# Altium project WiWi_SDR.PrjPcb (part 1 of 2)
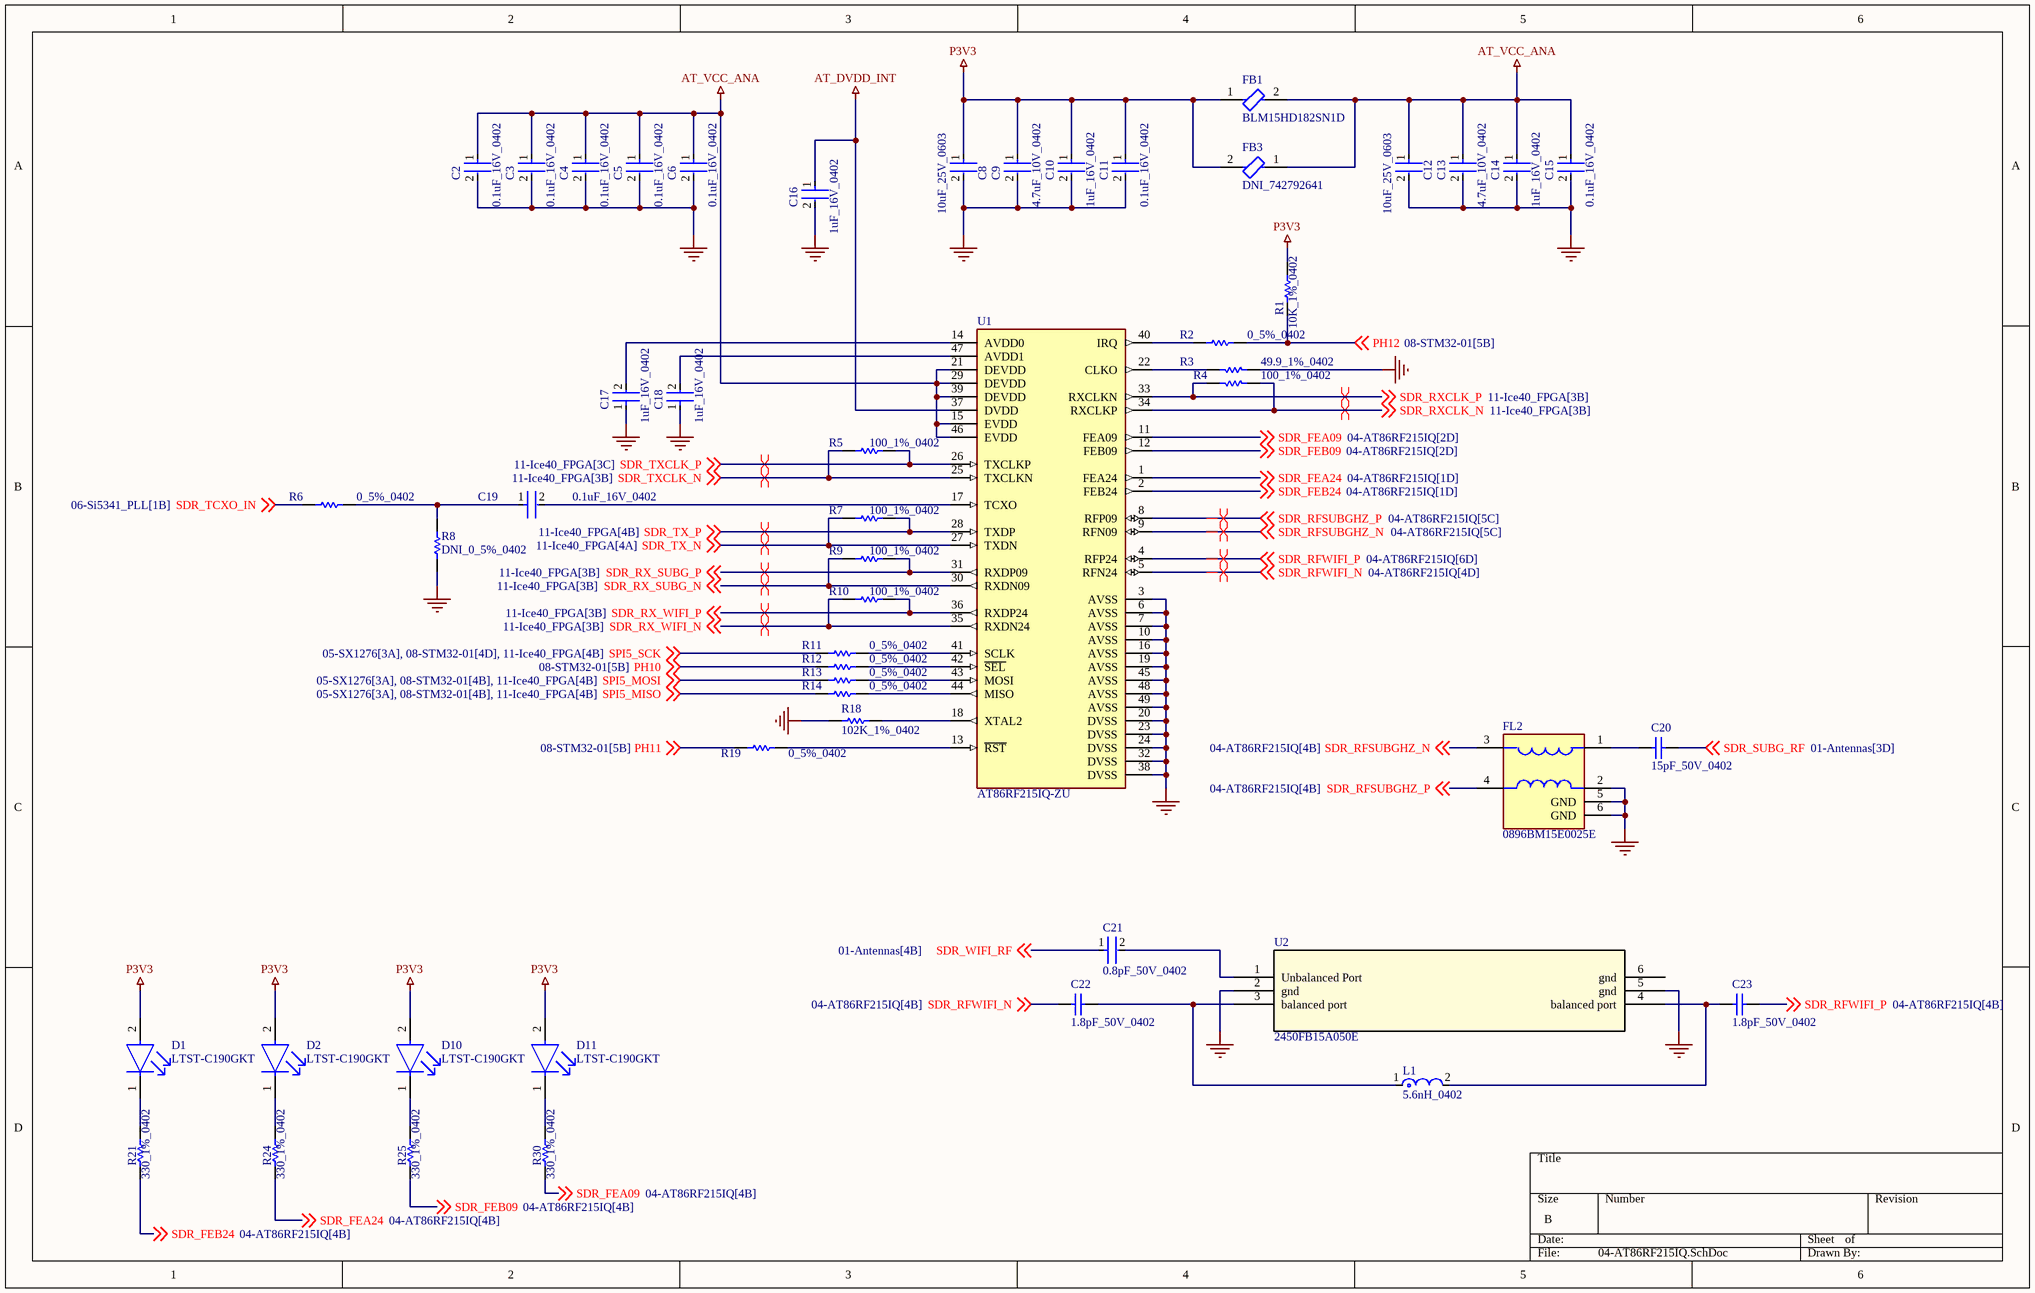
[diagram p0: 04-AT86RF215IQ.SchDoc]
prjCompanyName: Meta Platforms Technologies, LLC.; prjContactAddress1: 9845 Willows Road NE; prjContactAddress2: Redmond, WA 98052; prjContactEmail: Contact Email; prjContactPhone: (...)-...-....; prjElectricalEngineer: Electical Engineer; prjElectricalEngineerEmail: Electical Engineer Email; prjLayoutEngineer: Layout Engineer; prjLayoutEngineerEmail: Layout Engineer Email; prjMechanicalEngineer: Mechanical Engineer; prjMechanicalEngineerEmail: Mechanical Engineer Email; prjPCB_IPN: 844-XXXXX-XX; prjPCB_Name: PCB Name; prjPCB_Revision: X1; prjProjectName: Project Name; prjSchematic_IPN: 846-XXXXX-XX; prjSchematic_Revision: X1; XprjPCBA_IPN: Set v_prjPCBA_IPN in variant parameters; XprjPCBA_Revision: Set v_prjPCBA_Revision in variant parameters
8 sheets, 210 parts. Net scope: global (net labels, ports and power ports of the same name join across sheets).
Board file: WiWi_SDR_V1.PcbDoc
Sheets:
  03-SignalsTBD.SchDoc
  04-AT86RF215IQ.SchDoc
  10-USB-Prog.SchDoc
  11-Ice40_FPGA.SchDoc
  12-Power.SchDoc
  14-100M_Ethernet.SchDoc
  15-SDRAM_Flash.SchDoc
  16-ESP32S3.SchDoc

## Sheet 03-SignalsTBD.SchDoc
size B; SheetNumber: 3; SheetTotal: 16

## Sheet 04-AT86RF215IQ.SchDoc
size B; SheetNumber: 4; SheetTotal: 16

### Parts
C2  0.1uF_16V_0402  [FP-C0402-BB-MFG]
C3  0.1uF_16V_0402  [FP-C0402-BB-MFG]
C4  0.1uF_16V_0402  [FP-C0402-BB-MFG]
C5  0.1uF_16V_0402  [FP-C0402-BB-MFG]
C6  0.1uF_16V_0402  [FP-C0402-BB-MFG]
C8  10uF_25V_0603  [FP-CL10-IPC_C]
C9  4.7uF_10V_0402  [FP-C1005-050-0_15-MFG]
C10  1uF_16V_0402  [FP-0402-L_1_0_0_05-W_0_5-IPC_A]
C11  0.1uF_16V_0402  [FP-C0402-BB-MFG]
C12  10uF_25V_0603  [FP-CL10-IPC_C]
C13  4.7uF_10V_0402  [FP-C1005-050-0_15-MFG]
C14  1uF_16V_0402  [FP-0402-L_1_0_0_05-W_0_5-IPC_A]
C15  0.1uF_16V_0402  [FP-C0402-BB-MFG]
C16  1uF_16V_0402  [FP-0402-L_1_0_0_05-W_0_5-IPC_A]
C17  1uF_16V_0402  [FP-0402-L_1_0_0_05-W_0_5-IPC_A]
C18  1uF_16V_0402  [FP-0402-L_1_0_0_05-W_0_5-IPC_A]
C19  0.1uF_16V_0402  [FP-C0402-BB-MFG]
C20  15pF_50V_0402  [CAPC1608X90X35ML10T15]
C21  0.8pF_50V_0402  [FP-GJM155-0_05-IPC_A]
C22  1.8pF_50V_0402  [CAPC1005X55X25LL05T10]
C23  1.8pF_50V_0402  [CAPC1005X55X25LL05T10]
D1  LTST-C190GKT  [FP-LTST-C190GKT-MFG]
D2  LTST-C190GKT  [FP-LTST-C190GKT-MFG]
D10  LTST-C190GKT  [FP-LTST-C190GKT-MFG]
D11  LTST-C190GKT  [FP-LTST-C190GKT-MFG]
FB1  BLM15HD182SN1D  [FP-BLM15-0_05-MFG]
FB3  DNI_742792641  [FP-742792641-MFG]  (no BOM)
FL2  0896BM15E0025E  [FP-0896BM15E0025E-MFG]
L1  5.6nH_0402  [FP-LQG15HH_02-IPC_A]
R1  10K_1%_0402  [RESC1005X40X25NL10T10]
R2  0_5%_0402  [RESC1005X40X25NL05T10]
R3  49.9_1%_0402  [RESC1005X40X25NL10T10]
R4  100_1%_0402  [RESC1005X40X25NL05T10]
R5  100_1%_0402  [RESC1005X40X25NL05T10]
R6  0_5%_0402  [RESC1005X40X25NL05T10]
R7  100_1%_0402  [RESC1005X40X25NL05T10]
R8  DNI_0_5%_0402  [RESC1005X40X25NL05T10]  (no BOM)
R9  100_1%_0402  [RESC1005X40X25NL05T10]
R10  100_1%_0402  [RESC1005X40X25NL05T10]
R11  0_5%_0402  [RESC1005X40X25NL05T10]
R12  0_5%_0402  [RESC1005X40X25NL05T10]
R13  0_5%_0402  [RESC1005X40X25NL05T10]
R14  0_5%_0402  [RESC1005X40X25NL05T10]
R18  102K_1%_0402  [RESC1005X40X25ML05T10]
R19  0_5%_0402  [RESC1005X40X25NL05T10]
R21  330_1%_0402  [RESC1005X40X25NL10T10]
R24  330_1%_0402  [RESC1005X40X25NL10T10]
R25  330_1%_0402  [RESC1005X40X25NL10T10]
R30  330_1%_0402  [RESC1005X40X25NL10T10]
U1  AT86RF215IQ-ZU  [FP-AT86RF215IQ-ZU-MFG]
U2  2450FB15A050E  [2450FB15A050E_JOT]

### Nets
AT_DVDD_INT: C16.1 U1.37(DVDD)
AT_VCC_ANA: C2.1 C3.1 C4.1 C5.1 C6.1 C12.1 C13.1 C14.1 C15.1 FB1.2 FB3.1 U1.15(EVDD) U1.21(DEVDD) U1.29(DEVDD) U1.39(DEVDD) U1.46(EVDD)
GND: C2.2 C3.2 C4.2 C5.2 C6.2 C8.2 C9.2 C10.2 C11.2 C12.2 C13.2 C14.2 C15.2 C16.2 C17.1 C18.1 FL2.2(GND) FL2.5(GND) FL2.6(GND) R3.2 R8.1 R18.1 U1.3(AVSS) U1.6(AVSS) U1.7(AVSS) U1.10(AVSS) U1.16(AVSS) U1.19(AVSS) U1.20(DVSS) U1.23(DVSS) U1.24(DVSS) U1.32(DVSS) U1.38(DVSS) U1.45(AVSS) U1.48(AVSS) U1.49(AVSS) U2.2(gnd) U2.5(gnd)
P3V3: C8.1 C9.1 C10.1 C11.1 D1.2(A) D2.2(A) D10.2(A) D11.2(A) FB1.1 FB3.2 R1.2
PH10: R12.1 ; off-sheet PH10
PH11: R19.1 ; off-sheet PH11
PH12: R1.1 R2.2 ; off-sheet PH12
SDR_FEA09: R30.1 U1.11(FEA09) ; off-sheet SDR_FEA09
SDR_FEA24: R24.1 U1.1(FEA24) ; off-sheet SDR_FEA24
SDR_FEB09: R25.1 U1.12(FEB09) ; off-sheet SDR_FEB09
SDR_FEB24: R21.1 U1.2(FEB24) ; off-sheet SDR_FEB24
SDR_RFSUBGHZ_N: FL2.3(1_Balanced_Port) U1.9(RFN09) ; off-sheet SDR_RFSUBGHZ_N
SDR_RFSUBGHZ_P: FL2.4(2_Balanced_Port) U1.8(RFP09) ; off-sheet SDR_RFSUBGHZ_P
SDR_RFWIFI_N: C22.1 U1.5(RFN24) ; off-sheet SDR_RFWIFI_N
SDR_RFWIFI_P: C23.2 U1.4(RFP24) ; off-sheet SDR_RFWIFI_P
SDR_RX_SUBG_N: R9.1 U1.30(RXDN09) ; off-sheet SDR_RX_SUBG_N
SDR_RX_SUBG_P: R9.2 U1.31(RXDP09) ; off-sheet SDR_RX_SUBG_P
SDR_RX_WIFI_N: R10.1 U1.35(RXDN24) ; off-sheet SDR_RX_WIFI_N
SDR_RX_WIFI_P: R10.2 U1.36(RXDP24) ; off-sheet SDR_RX_WIFI_P
SDR_RXCLK_N: R4.1 U1.34(RXCLKP) ; off-sheet SDR_RXCLK_N
SDR_RXCLK_P: R4.2 U1.33(RXCLKN) ; off-sheet SDR_RXCLK_P
SDR_SUBG_RF: C20.2 ; off-sheet SDR_SUBG_RF
SDR_TCXO_IN: R6.1 ; off-sheet SDR_TCXO_IN
SDR_TX_N: R7.1 U1.27(TXDN) ; off-sheet SDR_TX_N
SDR_TX_P: R7.2 U1.28(TXDP) ; off-sheet SDR_TX_P
SDR_TXCLK_N: R5.1 U1.25(TXCLKN) ; off-sheet SDR_TXCLK_N
SDR_TXCLK_P: R5.2 U1.26(TXCLKP) ; off-sheet SDR_TXCLK_P
SDR_WIFI_RF: C21.1 ; off-sheet SDR_WIFI_RF
SPI5_MISO: R14.1 ; off-sheet SPI5_MISO
SPI5_MOSI: R13.1 ; off-sheet SPI5_MOSI
SPI5_SCK: R11.1 ; off-sheet SPI5_SCK
NetC17_2: C17.2 U1.14(AVDD0)
NetC18_2: C18.2 U1.47(AVDD1)
NetC19_1: C19.1 R6.2 R8.2
NetC19_2: C19.2 U1.17(TCXO)
NetC20_1: C20.1 FL2.1(Unbalanced_Port)
NetC21_2: C21.2 U2.1(Unbalanced_Port)
NetC22_2: C22.2 L1.1 U2.3(balanced_port)
NetC23_1: C23.1 L1.2 U2.4(balanced_port)
NetD1_1: D1.1(C) R21.2
NetD2_1: D2.1(C) R24.2
NetD10_1: D10.1(C) R25.2
NetD11_1: D11.1(C) R30.2
NetR2_1: R2.1 U1.40(IRQ)
NetR3_1: R3.1 U1.22(CLKO)
NetR11_2: R11.2 U1.41(SCLK)
NetR12_2: R12.2 U1.42(~{SEL})
NetR13_2: R13.2 U1.43(MOSI)
NetR14_2: R14.2 U1.44(MISO)
NetR18_2: R18.2 U1.18(XTAL2)
NetR19_2: R19.2 U1.13(~{RST})

Not connected (* = marked no-connect by the designer): U2 6(gnd)

### Layout directives
differential pair: SDR_RFSUBGHZ_N, SDR_RFSUBGHZ_P, SDR_RFWIFI_N, SDR_RFWIFI_P, SDR_RX_SUBG_N, SDR_RX_SUBG_P, SDR_RX_WIFI_N, SDR_RX_WIFI_P, SDR_RXCLK_N, SDR_RXCLK_P, SDR_TX_N, SDR_TX_P, SDR_TXCLK_N, SDR_TXCLK_P

### Library data of the parts
C2-C6 C11 C15 C19 = CMP-1034-02068-3: CAP CER 0.1UF 16V 5% X7R 0402; Manufacturer: Kemet; Manufacturer Part Number: C0402C104J4RACTU; Value: 0.10 μF; Temperature Coefficient: 15%; Tolerance: 0.05; Material: Ceramic; ComponentLink2URL: https://content.kemet.com/datasheets/KEM_C1002_X7R_SMD.pdf; Automotive: No; Device Class L2: Capacitors; Temperature: -55°C to +125°C; RoHS: TRUE; Voltage Rating: 16 V; ComponentLink2Description: Datasheet; Device Class L3: Ceramic Capacitors; Temperature Range Low: -55°C; Ipc Land Pattern Name: CAPC10050X50; Device Class L1: Passive Components; Temperature Range High: +125°C; Package: C0402-BB; Capacitance: 0.10 μF; Category: Cap; Mouser Description: CAP CER 0.1UF 16V X7R 0402; Height: 0.55mm; Digikey Description: CAP CER 0.1UF 16V 5% X7R 0402; Octopart: https://octopart.com/c0402c104j4ractu-kemet-12573893; Temperature Characteristic: X7R; Lead Free: Yes
C8 C12 = CMP-13271-004224-1: Cap Ceramic 10uF 25V X5R ±20% Pad SMD 0603 +85°C T/R; Width: 0.031inch; Voltage Rating: 25V; Length: 0.063inch; Case Code (Metric): 1608; Dielectric: X5R; Termination: Wraparound; Capacitance: 10uF; Lead Free: Lead Free; Mount: Surface Mount; Package Quantity: 1; Case Code (Imperial): 0603; Thickness: 0.035inch; Packaging: Tape and Reel; Contact Plating: Tin; Min Operating Temperature: -55°C; Tolerance: 20%; Max Operating Temperature: 85°C; Case/Package: 0603
C9 C13 = CMP-2000-05997-2: CAP CER 4.7UF 10V X5R 0402; Dielectric Material: Ceramic; Tolerance: 10%; Series: C; Package Quantity: 10000; Max Operating Temperature: 85°C; Case Code (Imperial): 0402; Lead Free: Lead Free; Voltage Rating (DC): 10V; Packaging: Cut Tape; Voltage Rating: 10V; Min Operating Temperature: -55°C; Dielectric: X5R; Thickness: 0.022inch; Width: 0.02inch; Case/Package: 0402; Case Code (Metric): 1005; Capacitance: 4.7uF; Length: 0.039inch; RoHS Compliant: Yes; REACH SVHC: No SVHC; Mount: Surface Mount
C10 C14 C16-C18 = CMP-14477-000104-2: None; Tolerance: 10%; Voltage Rating: 16V; Dielectric: X5R; Capacitance: 1uF; Packaging: Tape and Reel; Depth: 0.5mm; Mount: Surface Mount; Thickness: 0.022inch; Package Quantity: 1; Min Operating Temperature: -55°C; Series: M; Voltage Rating (DC): 16V; Termination: SMD/SMT; Case/Package: 0402; Number of Pins: 2; Case Code (Imperial): 0402; Length: 1mm; Halogen Free: Halogen Free; Case Code (Metric): 1005; Width: 0.02inch; RoHS Compliant: Yes; Radiation Hardening: No; Max Operating Temperature: 85°C; Height: 0.5mm; Construction: Flat
C20 = CMP-2006-02610-1: Part Number: GRM1885C1H150JA01D; Manufacturer: Murata
C21 = CMP-2008-03912-2: Multi-Layer Ceramic Capacitor 0.8pF C0G  ±0.1pF 0402 Paper T/R; Voltage: 50V; Height: 0.5mm; Min Operating Temperature: -55°C; Mount: Surface Mount; Length: 1mm; Packaging: Tape and Reel; Package Quantity: 1; Max Operating Temperature: 125°C; Dielectric: C0G; Case Code (Imperial): 0402; Voltage Rating (DC): 50V; Voltage Rating: 50V; Case Code (Metric): 1005; Depth: 0.5mm; Case/Package: 0402; Width: 0.02inch; Termination: SMD/SMT; Thickness: 0.022inch; Capacitance: 0.8pF; Radiation Hardening: No; Lead Free: Lead Free
C22 C23 = CMP-2008-03916-1: Part Number: GRM1555C1H1R8CA01D; Manufacturer: Murata
D1 D2 D10 D11 = CMP-22017-000005-2: LED GREEN CLEAR CHIP SMD; Dominant Wavelength: 569nm; Reverse Voltage: 5V; Lens Color: Colorless; Viewing Angle: 130°; Voltage: 2V; Forward Current: 30mA; Power Dissipation: 100mW; Luminous Intensity: 6mcd; Number of LEDs: 1; Forward Voltage: 2.1V; Wavelength: 565nm; Test Current: 10mA; Min Operating Temperature: -55°C; Lens Style: Clear; Mount: Surface Mount; Width: 0.8mm; Packaging: Tape and Reel; Lens Transparency: Clear; Case Code (Metric): 1608; Depth: 0.8mm; Case Code (Imperial): 0603; Case/Package: 0603; Number of Pins: 2; Max Operating Temperature: 85°C; Lead Free: Lead Free; Number of Elements: 1; Length: 1.6mm; Height: 0.8mm; Package Quantity: 1; Power Rating: 100mW; Radiation Hardening: No; Illumination Color: Green; Color: Green
FB1 = CMP-0686-00276-4: Chip Ferrite Bead, 0402, 1800Ω @ 100MHz, 2.2Ω, 25%, 200mA; Impedance: 1.8kR; Number of Lines: 1; DC Resistance (DCR): 2.2R; Lead Free: Lead Free; Material: Ferrite; REACH SVHC: No SVHC; Current Rating: 200mA; Length: 1mm; Width: 0.5mm; Depth: 0.5mm; Max Operating Temperature: 125°C; Max DC Current: 200mA; Max Current Rating: 200mA; Case Code (Metric): 1005; Package Quantity: 1; Radiation Hardening: No; Number of Pins: 2; Tolerance: 25%; Number of Circuits: 1; Test Frequency: 100MHz; Termination: SMD/SMT; Military Standard: Not; Core Material: Ferrite; Height: 0.5mm; Case Code (Imperial): 0402; Packaging: Tape and Reel; Case/Package: 0402; DC Current: 200mA; Min Operating Temperature: -55°C
FB3 = CMP-0220-00171-2: FERRITE BEAD 300 OHM 0603 1LN; Inductance: 18nH; Max DC Current: 2A; Number of Lines: 1; Test Frequency: 100MHz; Impedance: 300R; DC Resistance (DCR): 150mR; Tolerance: 25%; Case Code (Metric): 1608; Core Material: Ferrite; Length: 1.6mm; Lead Free: Lead Free; Series: WE-CBF; Min Operating Temperature: -55°C; RoHS Compliant: Yes; Case/Package: SMD/SMT; Material: Ferrite; Max Operating Temperature: 125°C; Termination: SMD/SMT; Packaging: Tape and Reel; Weight: 0.000141oz; Case Code (Imperial): 0603; Width: 0.8mm; Mount: Surface Mount; Max Current Rating: 2A; Package Quantity: 1; Depth: 0.8mm; Current Rating: 2A; Height: 0.8mm
FL2 = CMP-56495-000001-1: BALUN 863MHZ-928MHZ 50/50 0805; Manufacturer: Johanson; Insertion Loss: 1.8dB; Frequency: 895.5MHz; Bandwidth: 863-928MHz; Filter Type: Low Pass; Automotive: No; Manufacturer Part Number: 0896BM15E0025E; Temperature Range Low: -40°C; Height: 1.05mm; Digikey Description: BALUN 863MHZ-928MHZ 50/50 0805; Mouser Description: Signal Conditioning 863/928MHz BALUN/FILTER; Category: Filter; ComponentLink2Description: Datasheet; Temperature: -40°C to +125°C; Lead Free: Yes; Temperature Range High: +125°C; ComponentLink2URL: https://www.johansontechnology.com/datasheets/0896BM15E0025/0896BM15E0025.pdf; Package: 0896BM15E0025E; Device Class L2: EMI / RFI Components; Device Class L3: RF; RoHS: TRUE; Octopart: https://octopart.com/0896bm15e0025e-johanson-71691697; Device Class L1: Passive Components
L1 = CMP-06042-000284-1: Multilayer type RF Inductor 5.6nH ±0.3nH 0.18Ω 600mA 0402; Core Material: Air; DC Current: 300mA; Shielding: Unshielded; Test Frequency: 100MHz; Self Resonant Frequency: 5.3GHz; Q Factor: 8; DC Resistance (DCR): 260mR; Package Quantity: 1; Number of Pins: 2; Height: 0.02inch; Mount: Surface Mount; Termination: SMD/SMT; Case/Package: 0402; Case Code (Metric): 1005; Packaging: Tape and Reel; Min Operating Temperature: -55°C; Max DC Current: 300mA; Width: 0.02inch; Case Code (Imperial): 0402; Lead Free: Lead Free; Inductance: 5.6nH; Max Operating Temperature: 125°C; REACH SVHC: No SVHC; Radiation Hardening: No; Height - Seated (Max): 0.022inch; Depth: 0.55mm; Military Standard: Not; Length: 1mm; Current Rating: 300mA
R1 = CMP-2002-04694-1: Manufacturer: Bourns; Part Number: CR0402-FX-1002GLF
R2 R6 R8 R11-R14 R19 = CMP-2002-06457-1: Manufacturer: Panasonic; Part Number: ERJ-U020R00X
R3 = CMP-2002-04448-1: Part Number: RK73H1ETTP49R9F; Manufacturer: KOA Speer
R4 R5 R7 R9 R10 = CMP-2002-07853-1: Manufacturer: Yageo; Part Number: RC0402FR-13100RL
R18 = CMP-2002-07345-1: Manufacturer: Yageo; Part Number: RC0402FR-07102KL
R21 R24 R25 R30 = CMP-2002-05853-1: Manufacturer: Panasonic; Part Number: ERA-2AED331X
U1 = CMP-06331-000021-1: IC RF TXRX 802.15.4 48VFQFN; Manufacturer: Microchip; Data Rate: 2.4Mbits/s; Min Supply Voltage: 1.8V; Standoff Height: 0mm; Interface: SPI,Other; Sensitivity: -123dBm; Max Supply Voltage: 3.6V; Max Frequency: 2483.5MHz; Temperature Range High: +85°C; ComponentLink2URL: http://ww1.microchip.com/downloads/en/devicedoc/atmel-42415-wireless-at86rf215_datasheet.pdf; Lead Free: Yes; Digikey Description: IC RF TXRX 802.15.4 48VFQFN; Temperature: -40°C to +85°C; RoHS: TRUE; ComponentLink2Description: Datasheet; Height: 0.9mm; Temperature Range Low: -40°C; Manufacturer Part Number: AT86RF215IQ-ZU; Footprint Url: http://ww1.microchip.com/downloads/en/appnotes/atmel-8826-seeprom-pcb-mounting-guidelines-surface-mount-packages-applicationnote.pdf; Category: IC; Automotive: No; Ipc Land Pattern Name: QFN50P700X700X85-48; Device Class L1: Integrated Circuits (ICs); Octopart: https://octopart.com/at86rf215iq-zu-microchip-77758620; Package: QFN48; Device Class L2: RF Semiconductors and Devices; Device Class L3: Transceivers
U2 = 2450FB15A050E: No Description Available; Mfr_Name: Johanson Technology; RefDes: RefDes; Type: Type

## Sheet 10-USB-Prog.SchDoc
size B; SheetNumber: 10; SheetTotal: 16
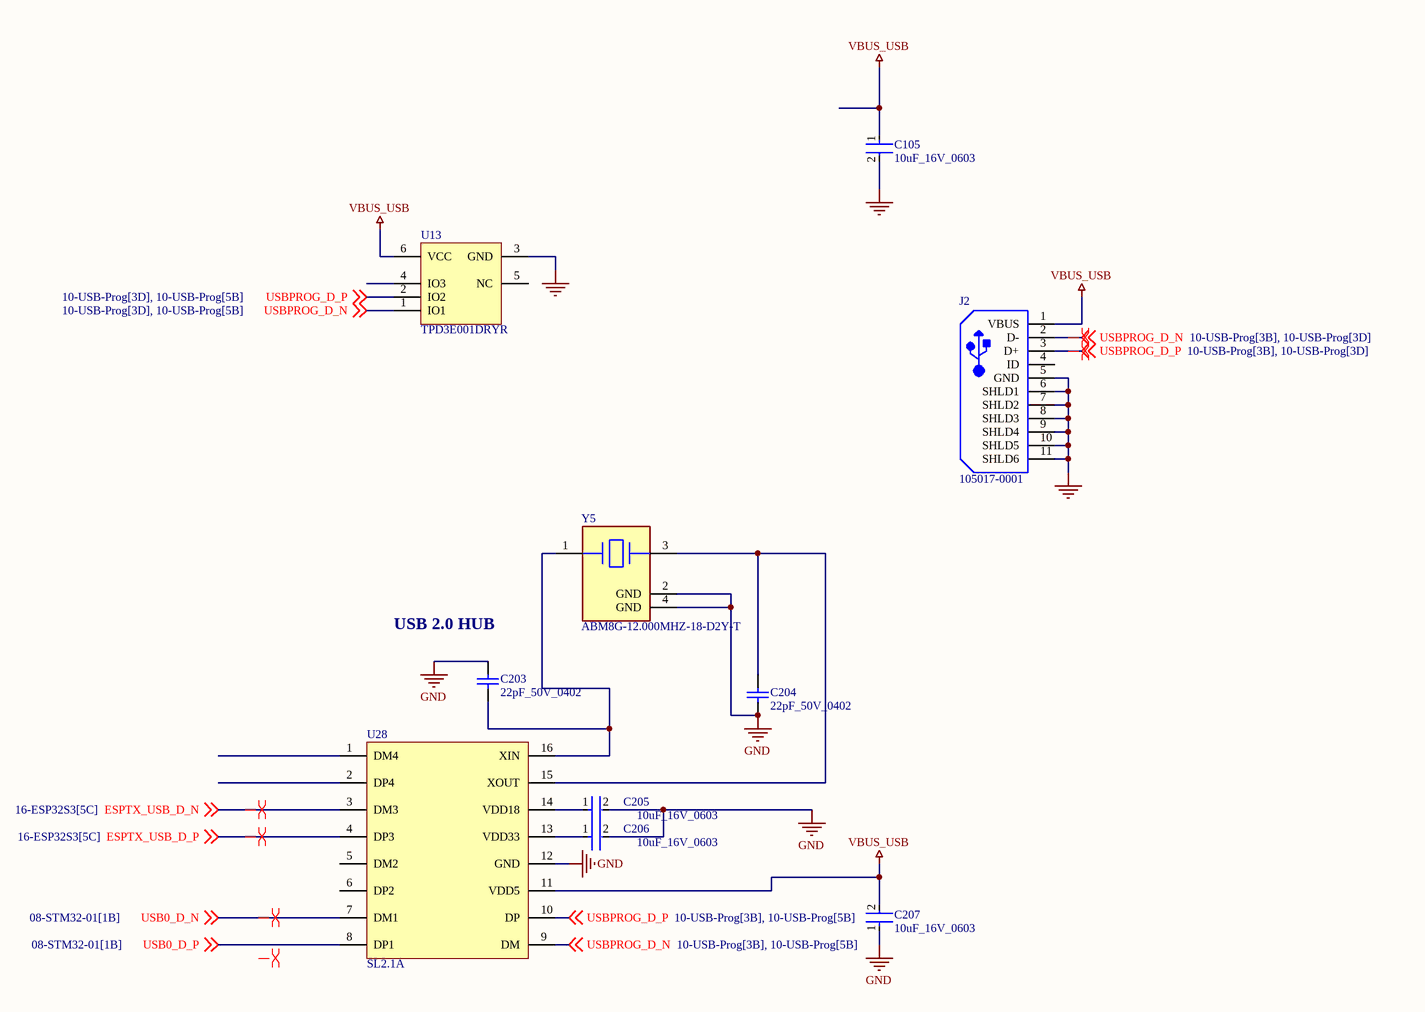
[diagram p1: 10-USB-Prog.SchDoc]

### Parts
C105  10uF_16V_0603  [FP-0603-L_1_6_0_2-W_0_8_0-MFG]
C203  22pF_50V_0402  [CAPC1005X55X25ML05T05]
C204  22pF_50V_0402  [CAPC1005X55X25ML05T05]
C205  10uF_16V_0603  [FP-0603-L_1_6_0_2-W_0_8_0-MFG]
C206  10uF_16V_0603  [FP-0603-L_1_6_0_2-W_0_8_0-MFG]
C207  10uF_16V_0603  [FP-0603-L_1_6_0_2-W_0_8_0-MFG]
J2  105017-0001  [USB-MICRO-B_V]
U13  TPD3E001DRYR  [DRY0006A]
U28  SL2.1A  [IC_SL2.1A]
Y5  ABM8G-12.000MHZ-18-D2Y-T  [FP-ABM8G-MFG]

### Nets
GND: C105.2 C203.2 C204.1 C205.2 C206.2 C207.1 J2.5(GND) J2.6(SHLD1) J2.7(SHLD2) J2.8(SHLD3) J2.9(SHLD4) J2.10(SHLD5) J2.11(SHLD6) U13.3(GND) U28.12(GND) Y5.2(GND) Y5.4(GND)
VBUS_USB: C105.1 C207.2 J2.1(VBUS) U13.6(VCC) U28.11(VDD5)
ESPTX_USB_D_N: U28.3(DM3) ; off-sheet ESPTX_USB_D_N
ESPTX_USB_D_P: U28.4(DP3) ; off-sheet ESPTX_USB_D_P
USB0_D_N: U28.7(DM1) ; off-sheet USB0_D_N
USB0_D_P: U28.8(DP1) ; off-sheet USB0_D_P
USBPROG_D_N: J2.2(D-) U13.1(IO1) U28.9(DM) ; off-sheet USBPROG_D_N
USBPROG_D_P: J2.3(D+) U13.2(IO2) U28.10(DP) ; off-sheet USBPROG_D_P
NetC203_1: C203.1 U28.16(XIN) Y5.1
NetC204_2: C204.2 U28.15(XOUT) Y5.3
NetC205_1: C205.1 U28.14(VDD18)
NetC206_1: C206.1 U28.13(VDD33)

Not connected (* = marked no-connect by the designer): J2 4(ID); U13 4(IO3) 5(NC); U28 1(DM4) 2(DP4) 5(DM2) 6(DP2)

### Layout directives
differential pair: (no net found under the mark), ESPTX_USB_D_N, ESPTX_USB_D_P, USB0_D_N, USBPROG_D_N, USBPROG_D_P

### Notes on the sheet
- (near C203) USB 2.0 HUB

### Library data of the parts
C105 C205-C207 = CMP-2000-06226-4: Multilayer Ceramic Capacitor 10uF 16V X5R 20% SMD 0603 T/R; Packaging: Tape and Reel; Construction: Flat; Height: 0.8mm; Max Operating Temperature: 85°C; Dielectric: X5R; Case Code (Metric): 1608; Voltage Rating (DC): 16V; Width: 0.031inch; Voltage Rating: 16V; Length: 0.063inch; RoHS Compliant: Yes; Halogen Free: Halogen Free; Case Code (Imperial): 0603; Capacitance: 10uF; Mount: Surface Mount; Thickness: 0.031inch; Tolerance: 20%; Min Operating Temperature: -55°C; Series: M; Termination: SMD/SMT; Case/Package: 0603; Package Quantity: 1
C203 C204 = CMP-2100-03590-1: Chip Capacitor, 22 pF, +/- 5%, 50 V, -55 to 125 degC, 0402 (1005 Metric), RoHS, Tape and Reel; Manufacturer: Yageo; Voltage Rating: 50V; Dielectric Material: Ceramic; Capacitance: 22pF; Temperature Coefficient: 30ppm/degC; Dielectric: C0G; Insulation Resistance: 100GR; Datasheet URL: http://www.yageo.com/NewPortal/yageodocoutput?fileName=/pdf/MLCC/UPY-GP_NP0_16V-to-50V_14.pdf; Depth: 0.5mm; Number of Pins: 2; Height: 0.5mm; Min Operating Temperature: -55degC; REACH SVHC: NoSVHC; Max Operating Temperature: 125degC; Voltage Rating (DC): 50V; Composition: Ceramic; Packaging: TapeandReel; Package Quantity: 1; Package Reference: 0402; Length: 1mm; Radiation Hardening: No; Package Description: 2-Pin Surface Mount Device, Body 1 x 0.5 mm; RoHSCompliant: True; Thickness: 0.022inch; Manufacturer URL: http://www.yageo.com/; Mount: SurfaceMount; Case Code (Metric): 1005; Case/Package: 0402; Tolerance: 5%; Termination: SMD/SMT; Width: 0.02inch; Datasheet Version: Rev. 14, 07/2016; Lead Free: LeadFree; Case Code (Imperial): 0402
J2 = CMP-2000-05827-1: Micro-USB B Receptacle, Right Angle, Bottom Mount, Surface Mount, with Solder Tabs, -30 to 85 degC, 5-Pin USB, RoHS, Tape and Reel; Manufacturer: Molex; Featured Product: Micro-USBConnectorsUSBConnectors; Other Names: WM1399DKR; Package Version: Rev. F, 12/2012; Number of Contacts: 5; Connector Type: USB-microB; Catalog Drawings: 1050170001; 3D Model: 105017-0001.stp; Mating Products: WM17145-ND-CABLEMICROUSBBTOSTDA1.0MWM17147-ND-CABLEMICROUSBBTOSTDA2.0MWM17146-ND-CABLEMICROUSBBTOSTDA1.5M; PCN Assembly/Origin: ResinSupplier21/Oct/2015; Voltage - Max: 30V; Online Catalog: Molex-MicroUSB; Manufacturer URL: http://www.molex.com/; Package Description: 5-Leads USB, Micro B, Body 7.5 x 5 mm, Pitch 0.65 mm; Datasheet URL: http://www.molex.com/elqNow/elqRedir.htm?ref=http://www.molex.com/webdocs/datasheets/pdf/en-us/1050170001_IO_CONNECTORS.pdf; Ingress Protection: -; Datasheet Version: 03/2016; Mounting Type: BoardCutout,SurfaceMount,RightAngle; Circuits: 5; Standard Package: 1; Package Reference: MICRO-B; Package URL: http://www.molex.com/pdm_docs/sd/1050170001_sd.pdf; Category: Connectors,Interconnects; Series: -; RoHS Information: 1050170001CertofCompliance; Features: Shielded,SolderRetention; Family: USB,DVI,HDMIConnectors; Specifications: -; Gender: Receptacle; Packaging: Digi-Reel®; Mounting Technology: SurfaceMount
U13 = CMP-0326-00032-3: Low-Capacitance + / - 15 kV ESD-Protection Array for High-Speed Data Interfaces, 3 Channels, -40 to +85 degC, 6-pin SON (DRY), Green (RoHS & no Sb/Br); Manufacturer: Texas Instruments; USB High Speed: TRUE; SubFamily: ESD Solution; IO Capacitance(Typ)(pF): 1.5; IEC 61000-4-2 Contact(+/- kV): 8; IO Leakage Current(nA): Jan-00; Breakdown Voltage(Min)(V): 11; IEC 61000-4-2 Air-Gap(+/- kV): 15; DatasheetVersion: SLLS683D; Mounting Technology: Surface Mount; ComponentLink1URL: http://www.ti.com/; PackageReference: DRY0006A; ComponentLink2URL: http://www.ti.com/general/docs/lit/getliterature.tsp?genericPartNumber=TPD3E001&fileType=pdf; ComponentLink2Description: Datasheet; ComponentLink3Description: URL Link1; PackageDescription: 6-Pin Plastic Small Outline No-Lead, 1 x 1.45 x 0.6 mm Body, 0.5 mm Pitch; ComponentLink1Description: Manufacturer URL; PackageVersion: revF, Dec-2011; PartNumber: TPD3E001DRYR; Eco-Plan: Green (RoHS & no Sb/Br); ComponentLink3URL: SamplesURL:http://www.ti.com/product/tpd3e001#samples
U28 = IC_SL2.1A: USB 2.0 HIGH SPEED 4-PORT HUB CONTROLLER; MF: CoreChips ShenZhen CO.,Ltd; Check_prices: https://www.snapeda.com/parts/SL2.1A/CoreChips%20ShenZhen%20CO.,Ltd/view-part/4219225/?ref=eda; Price: None; Availability: No availability data; Value: *; SnapEDA_Link: https://www.snapeda.com/parts/SL2.1A/CoreChips%20ShenZhen%20CO.,Ltd/view-part/4219225/?ref=snap; MP: SL2.1A; Package: Package; Supplier 1: LCSC; Supplier Part Number 1: C192893
Y5 = CMP-2000-05039-3: Crystal 12MHz ±20ppm (Tol) ±30ppm (Stability) 18pF FUND 120Ω 4-Pin SMD T/R; Series Resistance: 120R; Max Operating Temperature: 85°C; Mount: Surface Mount; Width: 2.5mm; Series: ABM8G; Termination: SMD/SMT; Frequency Tolerance: 20ppm; Tolerance: 20ppm; Min Operating Temperature: -40°C; Operating Frequency: 12 MHz; Depth: 2.5mm; Load Capacitance: 18pF; Number of Pins: 4; Length: 3.2mm; Radiation Hardening: No; Frequency Stability: 30ppm; Height: 1mm; Packaging: Tape and Reel; Package Quantity: 1000; ESR (Equivalent Series Resistance): 120R; Lead Free: Lead Free; Frequency: 12MHz; Case/Package: CSMD

## Sheet 11-Ice40_FPGA.SchDoc
size B; SheetNumber: 11; SheetTotal: 16
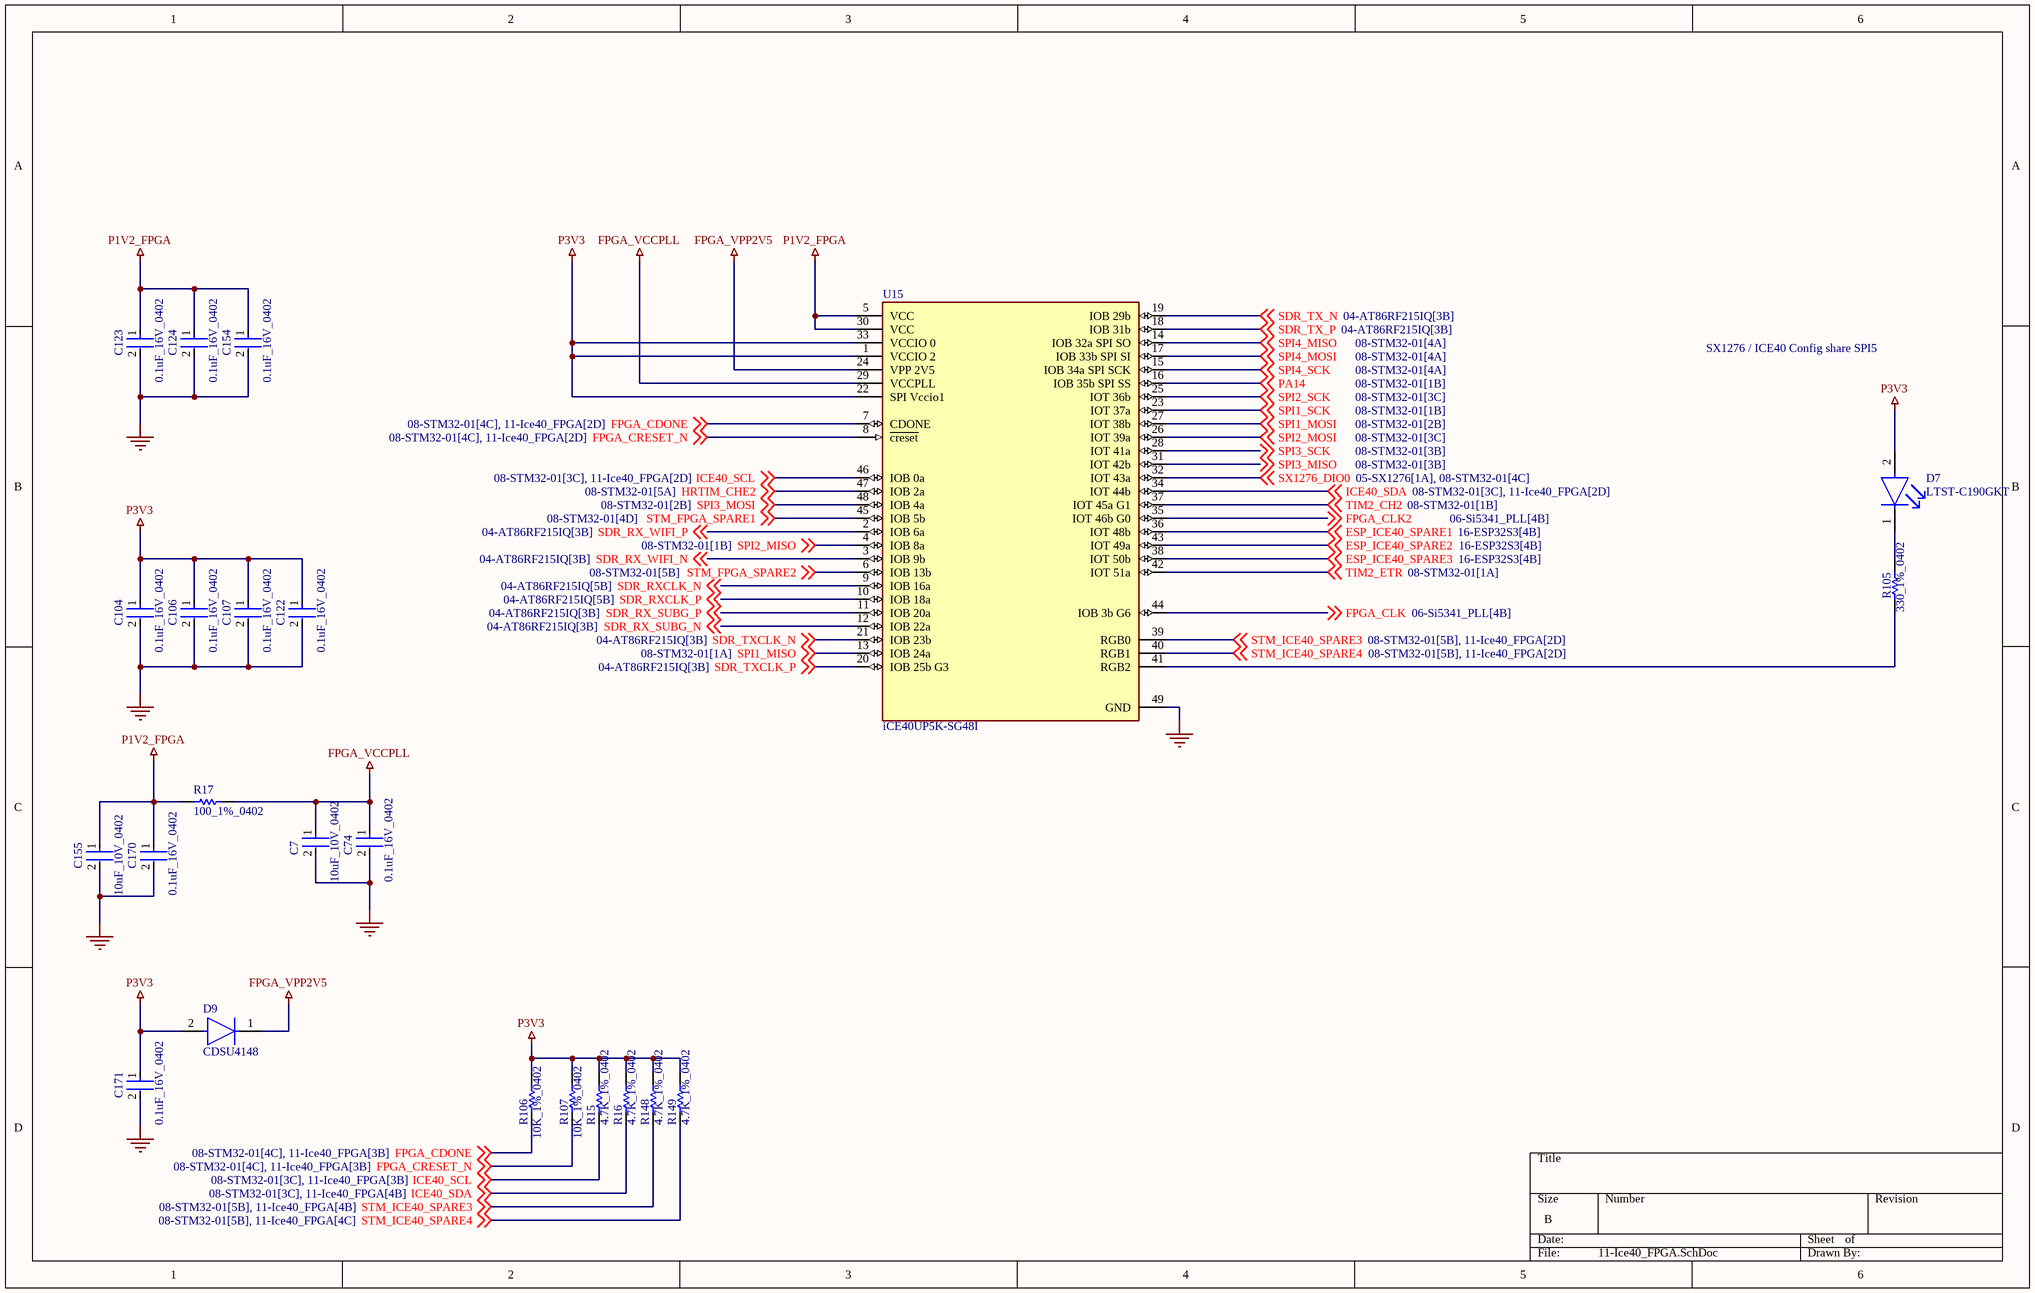
[diagram p2: 11-Ice40_FPGA.SchDoc]

### Parts
C7  10uF_10V_0402  [FP-CL05A106MP5NUNC-MFG]
C74  0.1uF_16V_0402  [FP-C0402-BB-MFG]
C104  0.1uF_16V_0402  [FP-C0402-BB-MFG]
C106  0.1uF_16V_0402  [FP-C0402-BB-MFG]
C107  0.1uF_16V_0402  [FP-C0402-BB-MFG]
C122  0.1uF_16V_0402  [FP-C0402-BB-MFG]
C123  0.1uF_16V_0402  [FP-C0402-BB-MFG]
C124  0.1uF_16V_0402  [FP-C0402-BB-MFG]
C154  0.1uF_16V_0402  [FP-C0402-BB-MFG]
C155  10uF_10V_0402  [FP-CL05A106MP5NUNC-MFG]
C170  0.1uF_16V_0402  [FP-C0402-BB-MFG]
C171  0.1uF_16V_0402  [FP-C0402-BB-MFG]
D7  LTST-C190GKT  [FP-LTST-C190GKT-MFG]
D9  CDSU4148  [FP-0603-SOD-523F-MFG]
R15  4.7K_1%_0402  [RESC1005X40X25NL10T10]
R16  4.7K_1%_0402  [RESC1005X40X25NL10T10]
R17  100_1%_0402  [RESC1005X40X25LL05T05]
R105  330_1%_0402  [RESC1005X40X25NL10T10]
R106  10K_1%_0402  [RESC1005X40X25NL10T10]
R107  10K_1%_0402  [RESC1005X40X25NL10T10]
R148  4.7K_1%_0402  [RESC1005X40X25NL10T10]
R149  4.7K_1%_0402  [RESC1005X40X25NL10T10]
U15  iCE40UP5K-SG48I  [FP-QFN-48-IPC_C]

### Nets
FPGA_VCCPLL: C7.1 C74.1 R17.2 U15.29(VCCPLL)
FPGA_VPP2V5: D9.1(C) U15.24(VPP_2V5)
GND: C7.2 C74.2 C104.2 C106.2 C107.2 C122.2 C123.2 C124.2 C154.2 C155.2 C170.2 C171.2 U15.49(GND)
P1V2_FPGA: C123.1 C124.1 C154.1 C155.1 C170.1 R17.1 U15.5(VCC) U15.30(VCC)
P3V3: C104.1 C106.1 C107.1 C122.1 C171.1 D7.2(A) D9.2(A) R15.2 R16.2 R106.2 R107.2 R148.2 R149.2 U15.1(VCCIO_2) U15.22(SPI_Vccio1) U15.33(VCCIO_0)
ESP_ICE40_SPARE1: U15.36(IOT_48b) ; off-sheet ESP_ICE40_SPARE1
ESP_ICE40_SPARE2: U15.43(IOT_49a) ; off-sheet ESP_ICE40_SPARE2
ESP_ICE40_SPARE3: U15.38(IOT_50b) ; off-sheet ESP_ICE40_SPARE3
FPGA_CDONE: R106.1 U15.7(CDONE) ; off-sheet FPGA_CDONE
FPGA_CLK: U15.44(IOB_3b_G6) ; off-sheet FPGA_CLK
FPGA_CLK2: U15.35(IOT_46b_G0) ; off-sheet FPGA_CLK2
FPGA_CRESET_N: R107.1 U15.8(~{creset}) ; off-sheet FPGA_CRESET_N
HRTIM_CHE2: U15.47(IOB_2a) ; off-sheet HRTIM_CHE2
ICE40_SCL: R15.1 U15.46(IOB_0a) ; off-sheet ICE40_SCL
ICE40_SDA: R16.1 U15.34(IOT_44b) ; off-sheet ICE40_SDA
PA14: U15.16(IOB_35b_SPI_SS) ; off-sheet PA14
SDR_RX_SUBG_N: U15.12(IOB_22a) ; off-sheet SDR_RX_SUBG_N
SDR_RX_SUBG_P: U15.11(IOB_20a) ; off-sheet SDR_RX_SUBG_P
SDR_RX_WIFI_N: U15.3(IOB_9b) ; off-sheet SDR_RX_WIFI_N
SDR_RX_WIFI_P: U15.2(IOB_6a) ; off-sheet SDR_RX_WIFI_P
SDR_RXCLK_N: U15.9(IOB_16a) ; off-sheet SDR_RXCLK_N
SDR_RXCLK_P: U15.10(IOB_18a) ; off-sheet SDR_RXCLK_P
SDR_TX_N: U15.19(IOB_29b) ; off-sheet SDR_TX_N
SDR_TX_P: U15.18(IOB_31b) ; off-sheet SDR_TX_P
SDR_TXCLK_N: U15.21(IOB_23b) ; off-sheet SDR_TXCLK_N
SDR_TXCLK_P: U15.20(IOB_25b_G3) ; off-sheet SDR_TXCLK_P
SPI1_MISO: U15.13(IOB_24a) ; off-sheet SPI1_MISO
SPI1_MOSI: U15.27(IOT_38b) ; off-sheet SPI1_MOSI
SPI1_SCK: U15.23(IOT_37a) ; off-sheet SPI1_SCK
SPI2_MISO: U15.4(IOB_8a) ; off-sheet SPI2_MISO
SPI2_MOSI: U15.26(IOT_39a) ; off-sheet SPI2_MOSI
SPI2_SCK: U15.25(IOT_36b) ; off-sheet SPI2_SCK
SPI3_MISO: U15.31(IOT_42b) ; off-sheet SPI3_MISO
SPI3_MOSI: U15.48(IOB_4a) ; off-sheet SPI3_MOSI
SPI3_SCK: U15.28(IOT_41a) ; off-sheet SPI3_SCK
SPI4_MISO: U15.14(IOB_32a_SPI_SO) ; off-sheet SPI4_MISO
SPI4_MOSI: U15.17(IOB_33b_SPI_SI) ; off-sheet SPI4_MOSI
SPI4_SCK: U15.15(IOB_34a_SPI_SCK) ; off-sheet SPI4_SCK
STM_FPGA_SPARE1: U15.45(IOB_5b) ; off-sheet STM_FPGA_SPARE1
STM_FPGA_SPARE2: U15.6(IOB_13b) ; off-sheet STM_FPGA_SPARE2
STM_ICE40_SPARE3: R148.1 U15.39(RGB0) ; off-sheet STM_ICE40_SPARE3
STM_ICE40_SPARE4: R149.1 U15.40(RGB1) ; off-sheet STM_ICE40_SPARE4
SX1276_DIO0: U15.32(IOT_43a) ; off-sheet SX1276_DIO0
TIM2_CH2: U15.37(IOT_45a_G1) ; off-sheet TIM2_CH2
TIM2_ETR: U15.42(IOT_51a) ; off-sheet TIM2_ETR
NetD7_1: D7.1(C) R105.2
NetR105_1: R105.1 U15.41(RGB2)

### Notes on the sheet
- SX1276 / ICE40 Config share SPI5

### Library data of the parts
C7 C155 = CMP-13271-000002-1: CAP CER 10UF 10V X5R 0402; Manufacturer Part Number: CL05A106MP5NUNC; Manufacturer: Samsung; Temperature Coefficient: 15%; Tolerance: 20%; Material: Ceramic; Octopart: https://octopart.com/cl05a106mp5nunc-samsung-22457395; Voltage Rating: 10V; RoHS: TRUE; Value: 10uF; Height: 0.7mm; Digikey Description: CAP CER 10UF 10V X5R 0402; Automotive: No; Package: CL05A106MP5NUNC; Device Class L1: Passive Components; Capacitance: 10uF; Temperature Range High: +85°C; ComponentLink2Description: Datasheet; Device Class L2: Capacitors; Temperature Characteristic: X5R; Temperature: -55°C to +85°C; ComponentLink2URL: http://www.samsungsem.com/kr/support/product-search/mlcc/__icsFiles/afieldfile/2019/05/10/19-CL05A106MP5NUNC.pdf; Device Class L3: Ceramic Capacitors; Category: Cap; Temperature Range Low: -55°C; Ipc Land Pattern Name: CAPC10050X50; Lead Free: Yes
C74 C104 C106 C107 C122-C124 C154 C170 C171 = CMP-1034-02068-3: as C2 on sheet 04-AT86RF215IQ; ComponentLink2URL: https://content.kemet.com/datasheets/KEM_C1002_X7R_SMD.pdf; Automotive: No; Device Class L2: Capacitors; Temperature: -55°C to +125°C; RoHS: TRUE; Voltage Rating: 16 V; ComponentLink2Description: Datasheet; Device Class L3: Ceramic Capacitors; Temperature Range Low: -55°C; Ipc Land Pattern Name: CAPC10050X50; Device Class L1: Passive Components; Temperature Range High: +125°C; Package: C0402-BB; Capacitance: 0.10 μF; Category: Cap; Mouser Description: CAP CER 0.1UF 16V X7R 0402; Height: 0.55mm; Digikey Description: CAP CER 0.1UF 16V 5% X7R 0402; Octopart: https://octopart.com/c0402c104j4ractu-kemet-12573893; Temperature Characteristic: X7R; Lead Free: Yes
D7 = CMP-22017-000005-2: as D1 on sheet 04-AT86RF215IQ; Min Operating Temperature: -55°C; Lens Style: Clear; Mount: Surface Mount; Width: 0.8mm; Packaging: Tape and Reel; Lens Transparency: Clear; Case Code (Metric): 1608; Depth: 0.8mm; Case Code (Imperial): 0603; Case/Package: 0603; Number of Pins: 2; Max Operating Temperature: 85°C; Lead Free: Lead Free; Number of Elements: 1; Length: 1.6mm; Height: 0.8mm; Package Quantity: 1; Power Rating: 100mW; Radiation Hardening: No; Illumination Color: Green; Color: Green
D9 = CMP-20228-000007-1: DIODE GEN PURP 75V 150MA 0603; Reverse Recovery Time: 4ns; Max Reverse Leakage Current: 2.5uA; Max Surge Current: 4A; Capacitance: 3pF; Current Rating: 100mA; Max Power Dissipation: 150mW; Polarity: Standard; Voltage Rating (DC): 75V; Average Rectified Current: 150mA; Packaging: Tape and Reel; Recovery Time: 4ns; Max Reverse Voltage (DC): 75V; Output Current: 100mA; Case/Package: SMD/SMT; Mount: Surface Mount; Lead Free: Lead Free; Package Quantity: 1
R15 R16 R148 R149 = CMP-2002-05217-1: Manufacturer: Bourns; Part Number: CR0402-FX-4701GLF
R17 = CMP-2002-00605-3: Chip Resistor, 100 Ohm, +/- 1%, 100 mW, -55 to 155 degC, 0402 (1005 Metric), RoHS, Tape and Reel; Manufacturer: Basic Passives; PartNumber: ERJ-2RKF1000X; Power Rating: 100 mW; Resistance: 100 Ohm; Voltage Rating: 50 V; Case\/Package: 0402; Width: 0.5 mm; Pins: 2; ComponentLink2Description: Datasheet; PackageReference: 0402; Height: 0.35 mm; Tolerance: 1%; DatasheetVersion: 04/2015; Case Code (Imperial): 0402; Min Operating Temperature: -55 degC; Radiation Hardening: No; Length: 1 mm; Package Quantity: 10000; PackageDescription: 2-Pin Surface Mount Device, Body 1 x 0.5 mm; Mounting Technology: Surface Mount; Case Code (Metric): 1005; Packaging: Tape and Reel; ComponentLink1URL: http://www.panasonic.com/; RoHSCompliant: true; Max Operating Temperature: 155 degC; REACH SVHC: Yes; ComponentLink1Description: Manufacturer URL; ComponentLink2URL: http://industrial.panasonic.com/cdbs/www-data/pdf/RDA0000/AOA0000C86.pdf; Mount: Surface Mount
R105 = CMP-2002-05853-1: as R21 on sheet 04-AT86RF215IQ
R106 R107 = CMP-2002-04694-1: as R1 on sheet 04-AT86RF215IQ
U15 = CMP-17932-000001-1: ICE40-ULTRAPLUS, 5280 LUTS, 1.2V; Manufacturer: Lattice; Propagation Delay: 9ns; Frequency: 48MHz; Max Junction Temp: +100°C; Ram Size: 1024Kbits; Number Of Logic Elements Cells: 5280; Number Of I/Os: 39; Max Supply Voltage: 3.46V; Standoff Height: 0mm; Nominal Supply Current: 2.5-12mA; Min Supply Voltage: 1.14V; Number Of Logic Blocks: 660; Device Class L3: FPGAs - Field Programmable Gate Arrays; Temperature Range High: +100°C; Device Class L1: Integrated Circuits (ICs); Device Class L2: Embedded Processors and Controllers; Ipc Land Pattern Name: QFN50P700X700X90-48; Automotive: No; RoHS: TRUE; Lead Free: Yes; Height: 1mm; ComponentLink2Description: Datasheet; Manufacturer Part Number: iCE40UP5K-SG48I; Temperature Range Low: -40°C; Package: QFN-48; Temperature: -40°C to +100°C; Octopart: https://octopart.com/ice40up5k-sg48i-lattice+semiconductor-87369311; Footprint Url: http://www.latticesemi.com/view_document?document_id=213; Digikey Description: ICE40-ULTRAPLUS, 5280 LUTS, 1.2V; ComponentLink2URL: http://www.latticesemi.com/view_document?document_id=51968; Category: IC

## Sheet 12-Power.SchDoc
size B; SheetNumber: 12; SheetTotal: 16
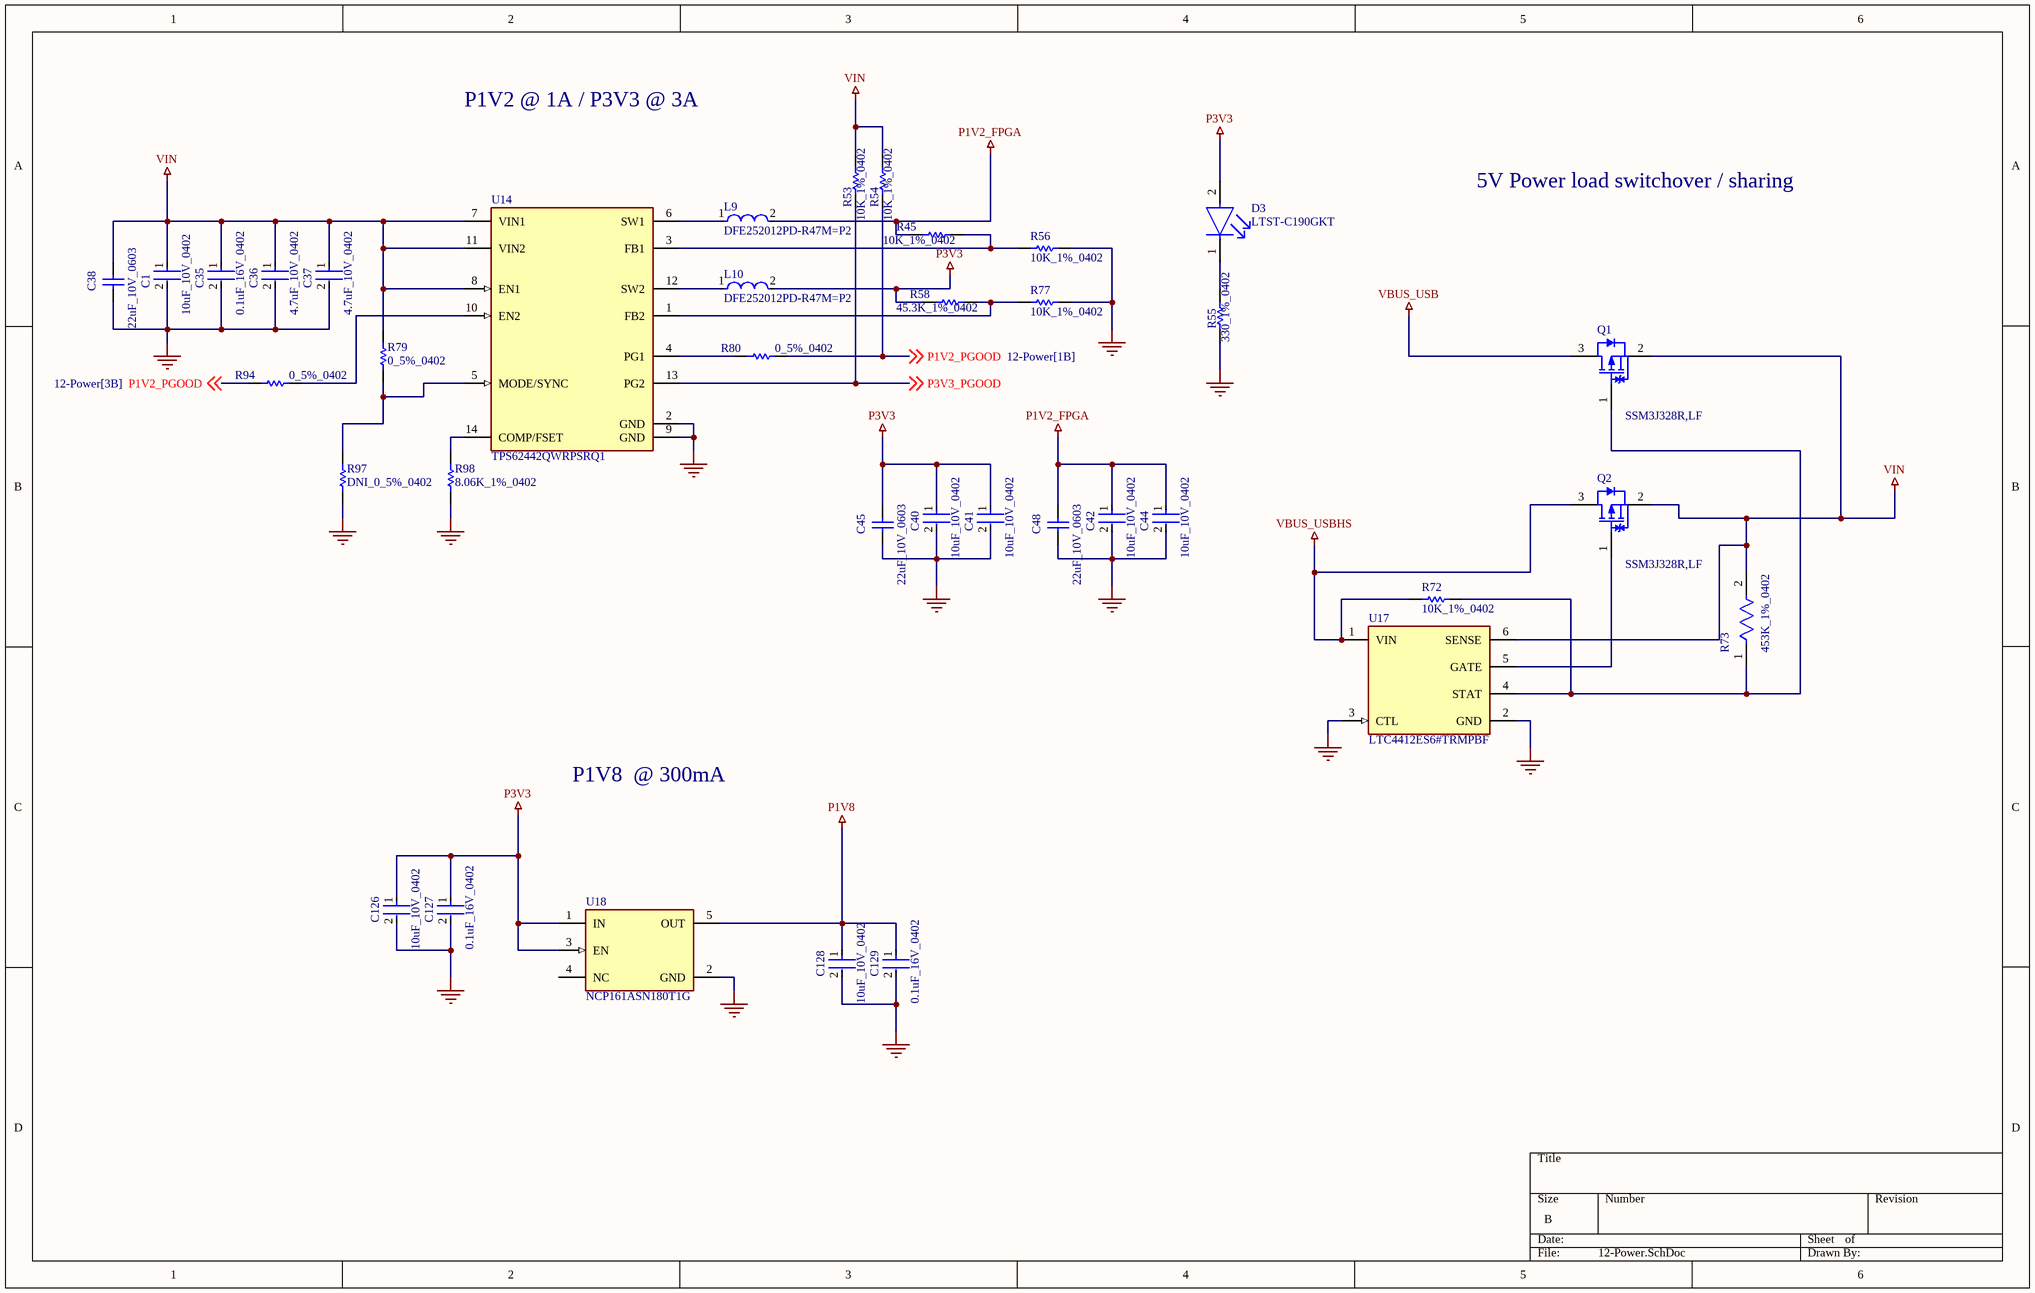
[diagram p3: 12-Power.SchDoc]

### Parts
C1  10uF_10V_0402  [FP-CL05A106MP5NUNC-MFG]
C35  0.1uF_16V_0402  [FP-C0402-BB-MFG]
C36  4.7uF_10V_0402  [FP-C1005-050-0_15-MFG]
C37  4.7uF_10V_0402  [FP-C1005-050-0_15-MFG]
C38  22uF_10V_0603  [CAPC1608X100X20ML10]
C40  10uF_10V_0402  [FP-CL05A106MP5NUNC-MFG]
C41  10uF_10V_0402  [FP-CL05A106MP5NUNC-MFG]
C42  10uF_10V_0402  [FP-CL05A106MP5NUNC-MFG]
C44  10uF_10V_0402  [FP-CL05A106MP5NUNC-MFG]
C45  22uF_10V_0603  [CAPC1608X100X20ML10]
C48  22uF_10V_0603  [CAPC1608X100X20ML10]
C126  10uF_10V_0402  [FP-CL05A106MP5NUNC-MFG]
C127  0.1uF_16V_0402  [FP-C0402-BB-MFG]
C128  10uF_10V_0402  [FP-CL05A106MP5NUNC-MFG]
C129  0.1uF_16V_0402  [FP-C0402-BB-MFG]
D3  LTST-C190GKT  [FP-LTST-C190GKT-MFG]
L9  DFE252012PD-R47M=P2  [FP-DFE252012C-IPC_A]
L10  DFE252012PD-R47M=P2  [FP-DFE252012C-IPC_A]
Q1  SSM3J328R,LF  [TOSH-SOT-23F_V]
Q2  SSM3J328R,LF  [TOSH-SOT-23F_V]
R45  10K_1%_0402  [RESC1005X40X25NL10T10]
R53  10K_1%_0402  [RESC1005X40X25NL10T10]
R54  10K_1%_0402  [RESC1005X40X25NL10T10]
R55  330_1%_0402  [RESC1005X40X25NL10T10]
R56  10K_1%_0402  [RESC1005X40X25NL10T10]
R58  45.3K_1%_0402  [RESC0402(1005)_L]
R72  10K_1%_0402  [RESC1005X40X25NL10T10]
R73  453K_1%_0402  [FP-RC1005-IPC_B]
R77  10K_1%_0402  [RESC1005X40X25NL10T10]
R79  0_5%_0402  [RESC1005X40X25NL05T10]
R80  0_5%_0402  [RESC1005X40X25NL05T10]
R94  0_5%_0402  [RESC1005X40X25NL05T10]
R97  DNI_0_5%_0402  [RESC1005X40X25NL05T10]  (no BOM)
R98  8.06K_1%_0402  [RESC1005X40X25ML05T05]
U14  TPS62442QWRPSRQ1  [FP-RQR0014A-MFG]
U17  LTC4412ES6#TRMPBF  [FP-S6-6-05-08-1636-IPC_C]
U18  NCP161ASN180T1G  [FP-527AH-MFG]

### Nets
GND: C1.2 C35.2 C36.2 C37.2 C38.1 C40.2 C41.2 C42.2 C44.2 C45.1 C48.1 C126.2 C127.2 C128.2 C129.2 R55.1 R56.1 R77.1 R97.1 R98.1 U14.2(GND) U14.9(GND) U17.2(GND) U17.3(CTL) U18.2(GND)
P1V2_FPGA: C42.1 C44.1 C48.2 L9.2 R45.2
P1V8: C128.1 C129.1 U18.5(OUT)
P3V3: C40.1 C41.1 C45.2 C126.1 C127.1 D3.2(A) L10.2 R58.1 U18.1(IN) U18.3(EN)
VBUS_USB: Q1.3(D)
VBUS_USBHS: Q2.3(D) R72.1 U17.1(VIN)
VIN: C1.1 C35.1 C36.1 C37.1 C38.2 Q1.2(S) Q2.2(S) R53.2 R54.2 R73.2 R79.2 U14.7(VIN1) U14.8(EN1) U14.11(VIN2) U17.6(SENSE)
P1V2_PGOOD: R54.1 R80.2 R94.1 ; off-sheet P1V2_PGOOD
P3V3_PGOOD: R53.1 U14.13(PG2) ; off-sheet P3V3_PGOOD
NetD3_1: D3.1(C) R55.2
NetL9_1: L9.1 U14.6(SW1)
NetL10_1: L10.1 U14.12(SW2)
NetQ1_1: Q1.1(G) R72.2 R73.1 U17.4(STAT)
NetQ2_1: Q2.1(G) U17.5(GATE)
NetR45_1: R45.1 R56.2 U14.3(FB1)
NetR58_2: R58.2 R77.2 U14.1(FB2)
NetR79_1: R79.1 R97.2 U14.5(MODE/SYNC)
NetR80_1: R80.1 U14.4(PG1)
NetR94_2: R94.2 U14.10(EN2)
NetR98_2: R98.2 U14.14(COMP/FSET)

Not connected (* = marked no-connect by the designer): U18 4(NC)

### Notes on the sheet
- P1V2 @ 1A / P3V3 @ 3A
- 5V Power load switchover / sharing
- P1V8  @ 300mA

### Library data of the parts
C1 C40-C42 C44 C126 C128 = CMP-13271-000002-1: as C7 on sheet 11-Ice40_FPGA; Octopart: https://octopart.com/cl05a106mp5nunc-samsung-22457395; Voltage Rating: 10V; RoHS: TRUE; Value: 10uF; Height: 0.7mm; Digikey Description: CAP CER 10UF 10V X5R 0402; Automotive: No; Package: CL05A106MP5NUNC; Device Class L1: Passive Components; Capacitance: 10uF; Temperature Range High: +85°C; ComponentLink2Description: Datasheet; Device Class L2: Capacitors; Temperature Characteristic: X5R; Temperature: -55°C to +85°C; ComponentLink2URL: http://www.samsungsem.com/kr/support/product-search/mlcc/__icsFiles/afieldfile/2019/05/10/19-CL05A106MP5NUNC.pdf; Device Class L3: Ceramic Capacitors; Category: Cap; Temperature Range Low: -55°C; Ipc Land Pattern Name: CAPC10050X50; Lead Free: Yes
C35 C127 C129 = CMP-1034-02068-3: as C2 on sheet 04-AT86RF215IQ; ComponentLink2URL: https://content.kemet.com/datasheets/KEM_C1002_X7R_SMD.pdf; Automotive: No; Device Class L2: Capacitors; Temperature: -55°C to +125°C; RoHS: TRUE; Voltage Rating: 16 V; ComponentLink2Description: Datasheet; Device Class L3: Ceramic Capacitors; Temperature Range Low: -55°C; Ipc Land Pattern Name: CAPC10050X50; Device Class L1: Passive Components; Temperature Range High: +125°C; Package: C0402-BB; Capacitance: 0.10 μF; Category: Cap; Mouser Description: CAP CER 0.1UF 16V X7R 0402; Height: 0.55mm; Digikey Description: CAP CER 0.1UF 16V 5% X7R 0402; Octopart: https://octopart.com/c0402c104j4ractu-kemet-12573893; Temperature Characteristic: X7R; Lead Free: Yes
C36 C37 = CMP-2000-05997-2: as C9 on sheet 04-AT86RF215IQ; Series: C; Package Quantity: 10000; Max Operating Temperature: 85°C; Case Code (Imperial): 0402; Lead Free: Lead Free; Voltage Rating (DC): 10V; Packaging: Cut Tape; Voltage Rating: 10V; Min Operating Temperature: -55°C; Dielectric: X5R; Thickness: 0.022inch; Width: 0.02inch; Case/Package: 0402; Case Code (Metric): 1005; Capacitance: 4.7uF; Length: 0.039inch; RoHS Compliant: Yes; REACH SVHC: No SVHC; Mount: Surface Mount
C38 C45 C48 = CMP-2000-05441-1: Chip Capacitor, 22 uF, +/- 20%, 10 V, -55 to 85 degC, 0603 (1608 Metric), RoHS, Tape and Reel; Manufacturer: TDK; PCN Part Number: MLCCPartNumberChange30/Nov/2012; Voltage - Rated: 10V; Product Training Modules: CSeriesGeneralApplicationsSEAT,CCV,andTVCLDesignToolsGuidetoReplacinganElectrolyticCapacitorwithanMLCC; Other Names: 445-9077-1; Design Resources: 20WNon-IsolatedBuckLEDDriverUsingPLLNK460KG; Online Catalog: CSeries,GeneralPurpose; Capacitance: 22µF; Temperature Coefficient: X5R; Kits: 445-9014-KIT-ND-KITMLCC100PF-22UF060310-50V; Packaging: CutTape(CT); Standard Package: 1; Package / Case: 0603(1608Metric); Lead Style: -; Features: -; Ratings: -; Operating Temperature: -55degC~85degC; Applications: GeneralPurpose; Package Reference: 603; Datasheet URL: http://download.siliconexpert.com/pdfs/2015/4/21/15/54/45/779/tdk_/manual/37024850441143360mlcc_commercial_general_en.pdf; Datasheet Version: Mar-15; Mounting Type: SurfaceMount,MLCC; Lead Spacing: -; Size / Dimension: 0.063"Lx0.031"W(1.60mmx0.80mm); Height - Seated (Max): -; Package Description: 2-Pin Surface Mount Device, Body 1.6 x 0.8 mm; Manufacturer URL: http://www.tdk.com/; RoHS Information: RoHSCertificate-MLCC; Tolerance: ±20%; Series: C; Thickness (Max): 0.035"(0.90mm); Family: CeramicCapacitors; Category: Capacitors
D3 = CMP-22017-000005-2: as D1 on sheet 04-AT86RF215IQ; Min Operating Temperature: -55°C; Lens Style: Clear; Mount: Surface Mount; Width: 0.8mm; Packaging: Tape and Reel; Lens Transparency: Clear; Case Code (Metric): 1608; Depth: 0.8mm; Case Code (Imperial): 0603; Case/Package: 0603; Number of Pins: 2; Max Operating Temperature: 85°C; Lead Free: Lead Free; Number of Elements: 1; Length: 1.6mm; Height: 0.8mm; Package Quantity: 1; Power Rating: 100mW; Radiation Hardening: No; Illumination Color: Green; Color: Green
L9 L10 = CMP-06042-015149-1: Shielded Wirewound Inductor 0.47uH 20% 4000mA 0.027Ω 1008 (2520)
Q1 Q2 = CMP-2100-03686-1: TOSHIBA Field-Effect Transistor Silicon P-Channel MOS Type (U-MOS VI), 20 V, -55 to 125 degC, 3-Pin SOTFL, RoHS, Tape and Reel; Gate to Source Voltage (Vgs): 8V; Drain to Source Breakdown Voltage: -20V; Turn-Off Delay Time: 107ns; Continuous Drain Current (ID): 6A; Rds On Max: 29.8mOhm; Number of Elements: 1; Turn-On Delay Time: 32ns; Drain to Source Resistance: 47.4mOhm; Drain to Source Voltage (Vdss): 20V; Power Dissipation: 2W; Element Configuration: Single; Max Power Dissipation: 1W; Input Capacitance: 840pF; Manufacturer URL: http://www.toshiba.com/; Number of Pins: 3; Number of Channels: 1; Max Operating Temperature: 150degC; Min Operating Temperature: -55degC; Manufacturer: Toshiba; Mount: SurfaceMount; Package Description: 3-Pin Small Outline Transistor, Flat Lead, Body 2.9 x 1.8 mm, Pitch 0.95 mm; Radiation Hardening: No; Package Quantity: 3000; Package Reference: SOT-23F; RoHSCompliant: true; Package URL: https://toshiba.semicon-storage.com/ap-en/design-support/package/detail.SOT-23F.html; Packaging: TapeandReel; Datasheet Version: 41699.0; Case/Package: SOT-23-3; Datasheet URL: https://toshiba.semicon-storage.com/info/docget.jsp?did=2429&prodName=SSM3J328R
R45 R53 R54 R56 R72 R77 = CMP-2002-04694-1: as R1 on sheet 04-AT86RF215IQ
R55 = CMP-2002-05853-1: as R21 on sheet 04-AT86RF215IQ
R58 = CMP-1011-00697-1: 45K3 0.063W 1% 0402 (1005 Metric)  SMD; Case-EIA: 0402; Case-Metric: 1005; Value: 45300.00 Ohm; Technology: SMT; Tolerance: 1 %; Power: 0.063 W
R73 = CMP-13261-000628-1: Res Thick Film 0402 453kΩ 1% 0.063W ±100ppm/°C Molded SMD T/R; Voltage Rating (DC): 50V; Max Power Dissipation: 63mW; Resistance: 453kR; Packaging: Tape and Reel; Number of Terminations: 2; Height: 0.016inch; Case Code (Imperial): 0402; Min Operating Temperature: -55°C; Tolerance: 1%; Features: Moisture Resistant; Length: 0.039inch; Power Rating: 63mW; Composition: Thick Film; Radiation Hardening: No; Temperature Coefficient: 100ppm/°C; Lead Free: Lead Free; Case Code (Metric): 1005; Width: 0.02inch; Max Operating Temperature: 155°C; Contact Plating: Tin; Case/Package: 0402
R79 R80 R94 R97 = CMP-2002-06457-1: as R2 on sheet 04-AT86RF215IQ
R98 = CMP-2002-00253-3: Chip Resistor, 8.06 KOhm, +/- 1%, 63 mW, -55 to 155 degC, 0402 (1005 Metric), RoHS, Tape and Reel; PartNumber: CRCW04028K06FKED; Manufacturer: Basic Passives; Case\/Package: 0402; Power Rating: 63 mW; Voltage Rating: 50 V; PackageReference: 0402; Radiation Hardening: No; Package Quantity: 10000; Height: 0.35 mm; Packaging: Tape and Reel; Mount: Surface Mount; Length: 1 mm; Weight: 2.3E-05oz; Case Code (Metric): 1005; DatasheetVersion: 06/2012; Pins: 2; Min Operating Temperature: -55 degC; Case Code (Imperial): 0402; REACH SVHC: Unknown; Tolerance: 1%; Mounting Technology: Surface Mount; ComponentLink1URL: http://www.vishay.com/; ComponentLink2URL: http://www.vishay.com/docs/20035/dcrcwe3.pdf; ComponentLink2Description: Datasheet; Resistance: 8.06 KOhm; Max Operating Temperature: 155 degC; ComponentLink1Description: Manufacturer URL; Width: 0.5 mm; RoHSCompliant: true; PackageDescription: 2-Pin Surface Mount Device, Body 1 x 0.5 mm
U14 = CMP-04918-000654-1: Adjustable-Frequency Dual Step-Down Converter, 2.7-6V VIN, 0.6-5.5V 2A VOUT, VQFN-HR14
U17 = CMP-0479-00425-2: IC OR CTRLR SRC SELECT TSOT23-6; Min Supply Voltage: 2.5V; Max Supply Voltage: 28V; Turn-On Delay Time: 110us; Number of Channels: 1; Lead Free: Lead Free; Length: 2.9mm; Radiation Hardening: No; RoHS Compliant: Yes; Package Quantity: 1; Min Operating Temperature: -40°C; Series: PowerPath™; Packaging: Tape and Reel; Width: 1.75mm; Height: 0.9mm; Number of Pins: 6; Max Operating Temperature: 85°C; Number of Outputs: 1; Case/Package: TSOT; REACH SVHC: No SVHC
U18 = CMP-00278-92192183-1: NCP161ASN180T1G LDO Regulator, 450 mA, Ultra-High PSRR, Ultra-Low Noise 1.8V, SOT23-5L, Active Discharge; Nominal Supply Current: 18µA; Output Type: Fixed; Number of Outputs: 1; Accuracy: 2%; Max Supply Voltage: 5.5V; Dropout Voltage: 365mV; Min Supply Voltage: 2.8V; Max Junction Temperature (Tj): 150°C; Output Current: 450mA; Output Voltage: 1.8V; Schedule B: 8542390000; Lifecycle Status: Production; NexarPartId: 92192183; Height: 1.45mm; Case/Package: SOT-23-5; RoHS: Compliant; Number of Channels: 1; Max Operating Temperature: 150°C; Manufacturer Lifecycle Status: ACTIVE